# Altium project Controller.PrjPcb (part 4 of 5)

## Sheet MCU.SchDoc
size A4; SheetNumber: 3; SheetTotal: 9
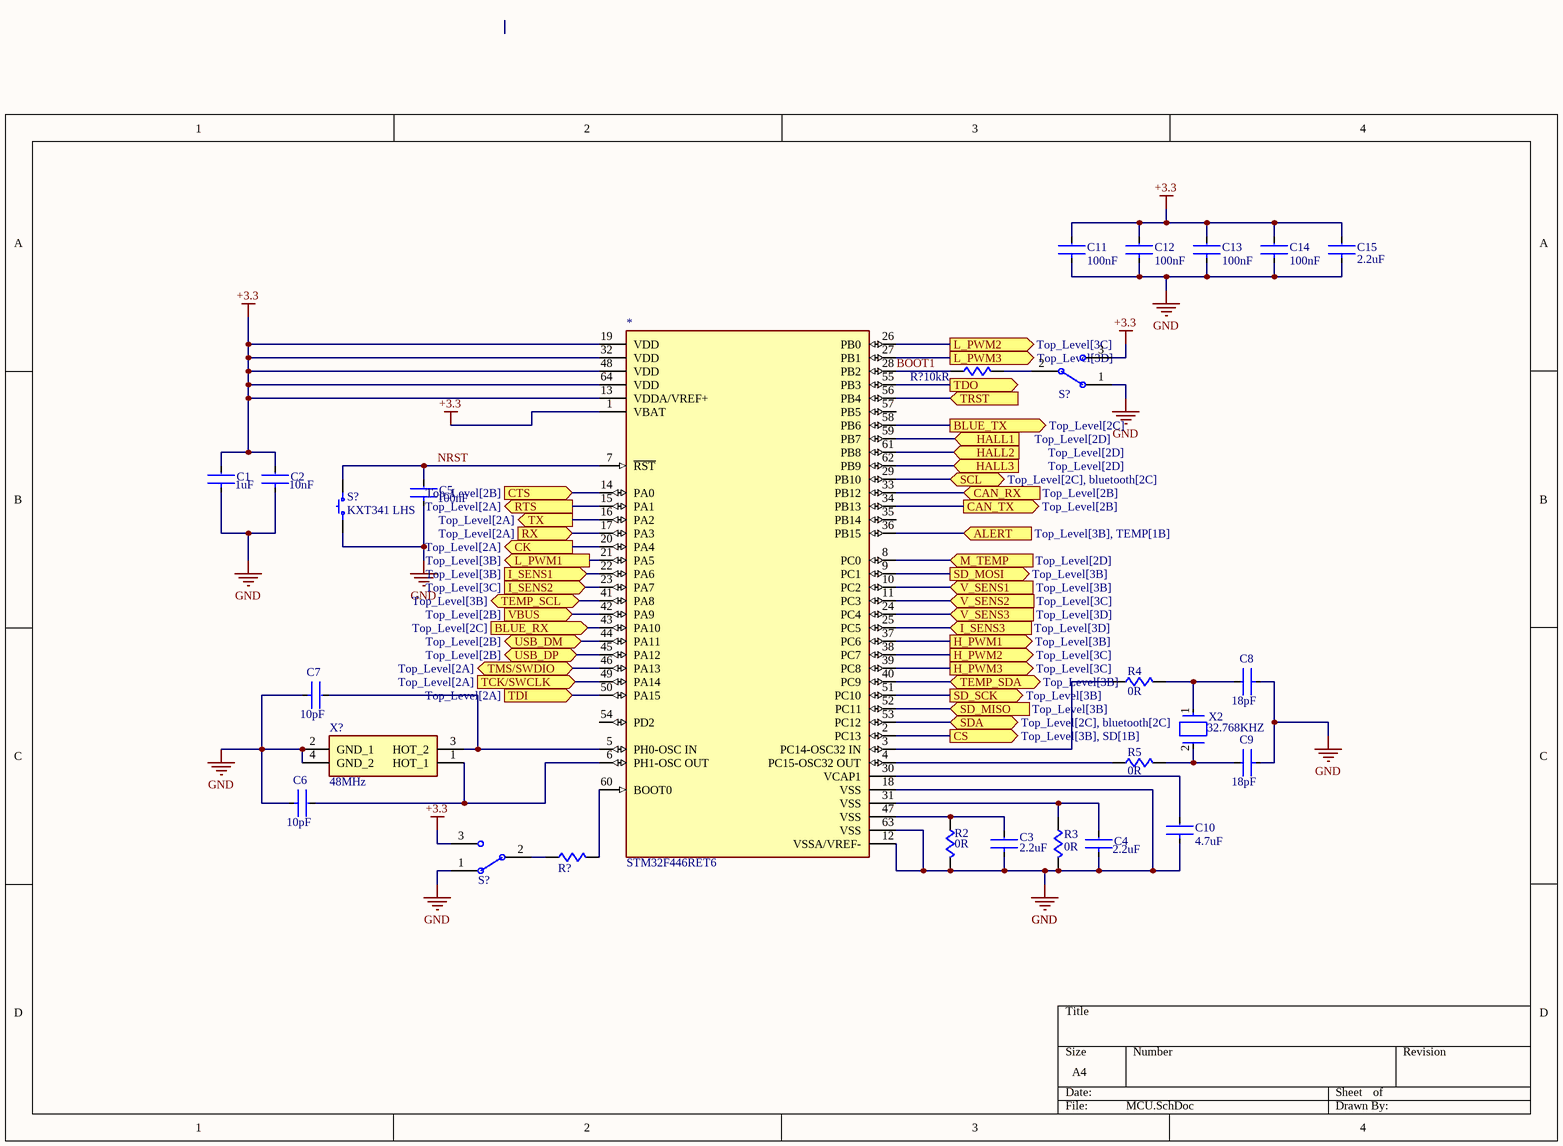
[diagram p3: MCU.SchDoc]

### Parts
(Parts that share a designator on the sheet are numbered #1, #2 ... from top to bottom, then left to right.)
*  STM32F446RET6  [FP-LQFP64-5W-IPC_B]
C1  value 1uF  [FP-CGA3E-0_3-0_1-IPC_C]  (hidden comment: CER 1UF 16V X7R 0603)
C2  value 10nF  [FP-CGA3E-0_3-0_1-IPC_C]  (hidden comment: CER 10000PF 100V X7R 0603)
C3  value 2.2uF  [FP-GRT188-0_2-IPC_A]  (hidden comment: CER 2.2UF 25V X6S 0603)
C4  value 2.2uF  [FP-GRT188-0_2-IPC_A]  (hidden comment: CER 2.2UF 25V X6S 0603)
C5  value 100nF  [FP-CGA3E-0_3-0_1-IPC_C]  (hidden comment: CER 0.1UF 50V X7R 0603)
C6  value 10pF  [FP-GCM188-0_1-IPC_C]  (hidden comment: CER 10PF 100V C0G/NP0 0603)
C7  value 10pF  [FP-GCM188-0_1-IPC_C]  (hidden comment: CER 10PF 100V C0G/NP0 0603)
C8  value 18pF  [FP-GCM188-0_1-IPC_C]  (hidden comment: CER 18PF 100V C0G/NP0 0603)
C9  value 18pF  [FP-GCM188-0_1-IPC_C]  (hidden comment: CER 18PF 100V C0G/NP0 0603)
C10  value 4.7uF  [FP-GCM31C-0_2-e0_3_0_8-IPC_C]  (hidden comment: CER 4.7UF 25V X7R 1206)
C11  value 100nF  [FP-CGA3E-0_3-0_1-IPC_C]  (hidden comment: CER 0.1UF 50V X7R 0603)
C12  value 100nF  [FP-CGA3E-0_3-0_1-IPC_C]  (hidden comment: CER 0.1UF 50V X7R 0603)
C13  value 100nF  [FP-CGA3E-0_3-0_1-IPC_C]  (hidden comment: CER 0.1UF 50V X7R 0603)
C14  value 100nF  [FP-CGA3E-0_3-0_1-IPC_C]  (hidden comment: CER 0.1UF 50V X7R 0603)
C15  value 2.2uF  [FP-GRT188-0_2-IPC_A]  (hidden comment: CER 2.2UF 25V X6S 0603)
R2  value 0R  [FP-RK73Z1J-IPC_C]  (hidden comment: RES 0 OHM JUMPER 0603)
R3  value 0R  [FP-RK73Z1J-IPC_C]  (hidden comment: RES 0 OHM JUMPER 0603)
R4  value 0R  [FP-RK73Z1J-IPC_C]  (hidden comment: RES 0 OHM JUMPER 0603)
R5  value 0R  [FP-RK73Z1J-IPC_C]  (hidden comment: RES 0 OHM JUMPER 0603)
R?#19  value 10kR  [FP-AC0402-IPC_B]  (hidden comment: RES SMD 10K OHM 1% 1/16W 0402)
R?#20  RES SMD 10K OHM 1% 1/16W 0402  [FP-AC0402-IPC_B]  (value not drawn)
S?#1  SLIDE SWITCH SPDT T/H ON-ON BBM  [OS102011MS2QN1C]  (value not drawn)
S?#2  KXT341 LHS  [C&K KXT3]
S?#3  SLIDE SWITCH SPDT T/H ON-ON BBM  [OS102011MS2QN1C]  (value not drawn)
X2  Operating Frequency-Nom: 32.768KHZ  [FP-NX3215SA-MFG]  (hidden comment: 32.7680KHZ 12.5PF SMD)
X?#1  value 48MHz  [CX3225SB48000D0FPJC1]  (hidden comment: CRYSTAL 48.0000MHZ 8PF SMD)

### Ports
ALERT (in, see Top_Level[3B], TEMP[1B]), BLUE_RX (in, see Top_Level[2C]), BLUE_TX (out, see Top_Level[2C]), CAN_RX (in, see Top_Level[2B]), CAN_TX (out, see Top_Level[2B]), CK (out, see Top_Level[2A]), CS (out, see Top_Level[3B], SD[1B]), CTS (in, see Top_Level[2B]), H_PWM1 (out, see Top_Level[3B]), H_PWM2 (out, see Top_Level[3C]), H_PWM3 (out, see Top_Level[3C]), HALL1 (in, see Top_Level[2D]), HALL2 (in, see Top_Level[2D]), HALL3 (in, see Top_Level[2D]), I_SENS1 (in, see Top_Level[3B]), I_SENS2 (in, see Top_Level[3C]), I_SENS3 (in, see Top_Level[3D]), L_PWM1 (out, see Top_Level[3B]), L_PWM2 (out, see Top_Level[3C]), L_PWM3 (out, see Top_Level[3D]), M_TEMP (in, see Top_Level[2D]), RTS (out, see Top_Level[2A]), RX (in, see Top_Level[2A]), SCL (bidir, see Top_Level[2C], bluetooth[2C]), SD_MISO (in, see Top_Level[3B]), SD_MOSI (out, see Top_Level[3B]), SD_SCK (out, see Top_Level[3B]), SDA (bidir, see Top_Level[2C], bluetooth[2C]), TCK/SWCLK (in, see Top_Level[2A]), TDI (in, see Top_Level[2A]), TDO (out, see Top_Level[2A]), TEMP_SCL (bidir, see Top_Level[3B]), TEMP_SDA (bidir, see Top_Level[3B]), TMS/SWDIO (bidir, see Top_Level[2A]), TRST (in, see Top_Level[2A]), TX (out, see Top_Level[2A]), USB_DM (bidir, see Top_Level[2B]), USB_DP (bidir, see Top_Level[2B]), V_SENS1 (in, see Top_Level[3B]), V_SENS2 (in, see Top_Level[3C]), V_SENS3 (in, see Top_Level[3D]), VBUS (in, see Top_Level[2B])

### Nets
+3.3: *.1(VBAT) *.13(VDDA/VREF+) *.19(VDD) *.32(VDD) *.48(VDD) *.64(VDD) C1.2 C2.2 C11.2 C12.2 C13.2 C14.2 C15.2 S?#1.3(NC) S?#3.3(NC)
GND: *.12(VSSA/VREF-) *.18(VSS) *.63(VSS) C1.1 C2.1 C3.1 C4.1 C5.1 C6.1 C7.1 C8.1 C9.1 C10.1 C11.1 C12.1 C13.1 C14.1 C15.1 R2.2 R3.2 S?#1.1(NO) S?#2.1 S?#3.1(NO) X?#1.2(GND_1) X?#1.4(GND_2)
BOOT1: *.28(PB2) R?#19.1
NRST: *.7(~{RST}) C5.2 S?#2.2
Net*_2: *.2(PC13) ; port CS
Net*_3: *.3(PC14-OSC32_IN) R4.1
Net*_4: *.4(PC15-OSC32_OUT) R5.1
Net*_5: *.5(PH0-OSC_IN) C7.2 X?#1.3(HOT_2)
Net*_6: *.6(PH1-OSC_OUT) C6.2 X?#1.1(HOT_1)
Net*_8: *.8(PC0) ; port M_TEMP
Net*_9: *.9(PC1) ; port SD_MOSI
Net*_10: *.10(PC2) ; port V_SENS1
Net*_11: *.11(PC3) ; port V_SENS2
Net*_14: *.14(PA0) ; port CTS
Net*_15: *.15(PA1) ; port RTS
Net*_16: *.16(PA2) ; port TX
Net*_17: *.17(PA3) ; port RX
Net*_20: *.20(PA4) ; port CK
Net*_21: *.21(PA5) ; port L_PWM1
Net*_22: *.22(PA6) ; port I_SENS1
Net*_23: *.23(PA7) ; port I_SENS2
Net*_24: *.24(PC4) ; port V_SENS3
Net*_25: *.25(PC5) ; port I_SENS3
Net*_26: *.26(PB0) ; port L_PWM2
Net*_27: *.27(PB1) ; port L_PWM3
Net*_29: *.29(PB10) ; port SCL
Net*_30: *.30(VCAP1) C10.2
Net*_31: *.31(VSS) C4.2 R3.1
Net*_33: *.33(PB12) ; port CAN_RX
Net*_34: *.34(PB13) ; port CAN_TX
Net*_36: *.36(PB15) ; port ALERT
Net*_37: *.37(PC6) ; port H_PWM1
Net*_38: *.38(PC7) ; port H_PWM2
Net*_39: *.39(PC8) ; port H_PWM3
Net*_40: *.40(PC9) ; port TEMP_SDA
Net*_41: *.41(PA8) ; port TEMP_SCL
Net*_42: *.42(PA9) ; port VBUS
Net*_43: *.43(PA10) ; port BLUE_RX
Net*_44: *.44(PA11) ; port USB_DM
Net*_45: *.45(PA12) ; port USB_DP
Net*_46: *.46(PA13) ; port TMS/SWDIO
Net*_47: *.47(VSS) C3.2 R2.1
Net*_49: *.49(PA14) ; port TCK/SWCLK
Net*_50: *.50(PA15) ; port TDI
Net*_51: *.51(PC10) ; port SD_SCK
Net*_52: *.52(PC11) ; port SD_MISO
Net*_53: *.53(PC12) ; port SDA
Net*_55: *.55(PB3) ; port TDO
Net*_56: *.56(PB4) ; port TRST
Net*_58: *.58(PB6) ; port BLUE_TX
Net*_59: *.59(PB7) ; port HALL1
Net*_60: *.60(BOOT0) R?#20.2
Net*_61: *.61(PB8) ; port HALL2
Net*_62: *.62(PB9) ; port HALL3
NetC8_2: C8.2 R4.2 X2.1
NetC9_2: C9.2 R5.2 X2.2
NetR?#19_2: R?#19.2 S?#1.2(COM)
NetR?#20_1: R?#20.1 S?#3.2(COM)

Not connected (* = marked no-connect by the designer): * 35(PB14) 54(PD2) 57(PB5)

### Notes on the sheet
- Labels drawn without touching a wire or pin: GND

### Library data of the parts
* = STM32F446RET6: RISC Microcontroller, 32-Bit, FLASH, CORTEX-M4F CPU, 180MHz, CMOS, PQFP64; Manufacturer: STMicroelectronics; Package Body Material: Plastic; Package Equivalence Code: QFP64,.47SQ,20; Power Supplies: 1.8/3.3V; Speed: 180RPM; Max Supply Current: 115mA; Qualification Status: Not Qualified; Supplier: Digi-Key; Supplier Part Number: 497-15376-ND; Manufacturer Part Number: STM32F446RET6; RoHS: Yes; Category: Microcontrollers; Stock: 18601; Pricing: 1=11.57, 10=10.456, 25=9.9696, 160=8.65644, 320=8.26741, 480=7.53794, 960=6.9474 (USD); Case/Package: QFP; Pins: 64; Package Shape: Square; Min Operating Temperature: -40°C; Max Operating Temperature: 85°C; JESD-30 Code: S-PQFP-G64; Package Style: FLATPACKMeter; Surface Mount: Yes; Technology: CMOS; Terminal Form: Gull Wing; Terminal Position: QUAD; Terminal Pitch: 0.5mm; Temperature Grade: INDUSTRIAL; Reach SVHC Compliant: Yes; RoHS Compliant: Yes; ComponentLink1URL: https://datasheet.ciiva.com:443/pdfs/VipMasterIC/IC/SGST/SGST-S-A0000954157/SGST-S-A0000954273-1.pdf?src-supplier=IHS+Markit; ComponentLink1Description: https://datasheet.ciiva.com:443/pdfs/VipMasterIC/IC/SGST/SGST-S-A0000954157/SGST-S-A0000954273-1.pdf?src-supplier=IHS+Markit; ComponentLink2URL: http://www.mouser.com/ds/2/389/stm32f446mc-956216.pdf?src-supplier=Mouser; ComponentLink2Description: http://www.mouser.com/ds/2/389/stm32f446mc-956216.pdf?src-supplier=Mouser; ComponentLink3URL: http://www.farnell.com/datasheets/2309063.pdf?src-supplier=Farnell; ComponentLink3Description: http://www.farnell.com/datasheets/2309063.pdf?src-supplier=Farnell; ComponentLink4URL: http://www.farnell.com/datasheets/2309063.pdf?src-supplier=Element14; ComponentLink4Description: http://www.farnell.com/datasheets/2309063.pdf?src-supplier=Element14; ComponentLink5URL: http://www.st.com/content/ccc/resource/technical/document/datasheet/65/cb/75/50/53/d6/48/24/DM00141306.pdf/files/DM00141306.pdf/jcr:content/translations/en.DM00141306.pdf?src-supplier=Digi-Key; ComponentLink5Description: http://www.st.com/content/ccc/resource/technical/document/datasheet/65/cb/75/50/53/d6/48/24/DM00141306.pdf/files/DM00141306.pdf/jcr:content/translations/en.DM00141306.pdf?src-supplier=Digi-Key; ComponentLink6URL: http://www.farnell.com/datasheets/2309063.pdf?src-supplier=Newark; ComponentLink6Description: http://www.farnell.com/datasheets/2309063.pdf?src-supplier=Newark
C1 = CGA3E1X7R1C105K080AC: Manufacturer: TDK; Dielectric Material: Ceramic; Multilayer: Yes; Tolerance  (fill in as +-): 10%; Reference Standard: AEC-Q200; Supplier: Digi-Key; Supplier Part Number: 445-12539-1-ND; Manufacturer Part Number: CGA3E1X7R1C105K080AC; RoHS: Yes; Category: Ceramic Capacitors; Stock: 2379528; Pricing: 1=0.12, 10=0.088, 50=0.0498, 100=0.0413, 500=0.02896, 1000=0.02397 (USD); Mounting Technology: Surface Mount; Pins: 2; Package Shape: Rectangular; Case/Package: 0603; Terminal Finish: Nickel; Min Operating Temperature: -55°C; Max Operating Temperature: 125°C; JESD-609 Code: e3; Capacitor Type: Ceramic; Package Style: SMTMeter; Packaging: Tape and Reel; Tolerance (fill in as +-): 10%; Rated DC Voltage (URdc): 16V; Temperature Characteristics Code: X7R; Termination: Wraparound; Length: 1.6mm; Width: 0.8mm; Height: 0.8mm; Reach SVHC Compliant: Yes; RoHS Compliant: Yes; ComponentLink1URL: https://datasheet.ciiva.com:443/pdfs/VipMasterIC/IC/TDKC/TDKC-S-A0008953915/TDKC-S-A0008953915-1.pdf?src-supplier=IHS+Markit; ComponentLink1Description: https://datasheet.ciiva.com:443/pdfs/VipMasterIC/IC/TDKC/TDKC-S-A0008953915/TDKC-S-A0008953915-1.pdf?src-supplier=IHS+Markit; ComponentLink2URL: http://www.farnell.com/datasheets/2292075.pdf?src-supplier=Farnell; ComponentLink2Description: http://www.farnell.com/datasheets/2292075.pdf?src-supplier=Farnell; ComponentLink3URL: https://product.tdk.com/info/en/documents/chara_sheet/CGA3E1X7R1C105K080AC.pdf?src-supplier=Digi-Key; ComponentLink3Description: https://product.tdk.com/info/en/documents/chara_sheet/CGA3E1X7R1C105K080AC.pdf?src-supplier=Digi-Key; ComponentLink4URL: https://product.tdk.com/info/en/catalog/datasheets/mlcc_automotive_general_en.pdf?src-supplier=Digi-Key; ComponentLink4Description: https://product.tdk.com/info/en/catalog/datasheets/mlcc_automotive_general_en.pdf?src-supplier=Digi-Key; ComponentLink5URL: http://product.tdk.com/capacitor/mlcc/en/documents/mlcc_automotive_general_en.pdf?src-supplier=Avnet; ComponentLink5Description: http://product.tdk.com/capacitor/mlcc/en/documents/mlcc_automotive_general_en.pdf?src-supplier=Avnet; ComponentLink6URL: http://www.farnell.com/datasheets/2292075.pdf?src-supplier=Element14; ComponentLink6Description: http://www.farnell.com/datasheets/2292075.pdf?src-supplier=Element14; ComponentLink7URL: http://www.farnell.com/datasheets/2292075.pdf?src-supplier=Newark; ComponentLink7Description: http://www.farnell.com/datasheets/2292075.pdf?src-supplier=Newark; ComponentLink8URL: http://product.tdk.com/capacitor/mlcc/detailed_information.php?lang=en&ref=jp&part_no=CGA3E1X7R1C105K080AC&src-supplier=Mouser; ComponentLink8Description: http://product.tdk.com/capacitor/mlcc/detailed_information.php?lang=en&ref=jp&part_no=CGA3E1X7R1C105K080AC&src-supplier=Mouser
C2 = GCM188R72A103KA37D: Manufacturer: Murata; Dielectric Material: Ceramic; Multilayer: Yes; Tolerance  (fill in as +-): 10%; Reference Standard: AEC-Q200; Supplier: Digi-Key; Supplier Part Number: 490-4781-1-ND; Manufacturer Part Number: GCM188R72A103KA37D; RoHS: Yes; Category: Ceramic Capacitors; Stock: 8991008; Pricing: 1=0.1, 10=0.057, 50=0.031, 100=0.0252, 500=0.01802, 1000=0.01417 (USD); Mounting Technology: Surface Mount; Pins: 2; Package Shape: Rectangular; Case/Package: 0603; Terminal Finish: Nickel; Min Operating Temperature: -55°C; Max Operating Temperature: 125°C; JESD-609 Code: e3; Capacitor Type: Ceramic; Package Style: SMTMeter; Packaging: Tape and Reel; Tolerance (fill in as +-): 10%; Rated DC Voltage (URdc): 100V; Temperature Characteristics Code: X7R; Termination: Wraparound; Length: 1.6mm; Width: 0.8mm; Height: 0.9mm; Reach SVHC Compliant: Yes; RoHS Compliant: Yes; ComponentLink1URL: https://psearch.en.murata.com:443/capacitor/product/GCM188R72A103KA37%23.pdf?src-supplier=IHS+Markit; ComponentLink1Description: https://psearch.en.murata.com:443/capacitor/product/GCM188R72A103KA37%23.pdf?src-supplier=IHS+Markit; ComponentLink2URL: https://datasheet.ciiva.com/132/product-132908.pdf?src-supplier=Digi-Key; ComponentLink2Description: https://datasheet.ciiva.com/132/product-132908.pdf?src-supplier=Digi-Key; ComponentLink3URL: https://datasheet.ciiva.com/132/product-132907.pdf?src-supplier=Digi-Key; ComponentLink3Description: https://datasheet.ciiva.com/132/product-132907.pdf?src-supplier=Digi-Key; ComponentLink4URL: https://datasheet.ciiva.com/132/product-132909.pdf?src-supplier=Digi-Key; ComponentLink4Description: https://datasheet.ciiva.com/132/product-132909.pdf?src-supplier=Digi-Key; ComponentLink5URL: https://datasheet.ciiva.com/16497/product-16497251.pdf?src-supplier=Future+Electronics; ComponentLink5Description: https://datasheet.ciiva.com/16497/product-16497251.pdf?src-supplier=Future+Electronics; ComponentLink6URL: https://datasheet.ciiva.com/18183/getdatasheetpartid-178890-18183651.pdf?src-supplier=Verical; ComponentLink6Description: https://datasheet.ciiva.com/18183/getdatasheetpartid-178890-18183651.pdf?src-supplier=Verical; ComponentLink7URL: https://datasheet.ciiva.com/11786/0900766b80ef92d0-11786108.pdf?src-supplier=Rs; ComponentLink7Description: https://datasheet.ciiva.com/11786/0900766b80ef92d0-11786108.pdf?src-supplier=Rs; ComponentLink8URL: https://datasheet.ciiva.com/11619/product-11619719.pdf?src-supplier=Avnet; ComponentLink8Description: https://datasheet.ciiva.com/11619/product-11619719.pdf?src-supplier=Avnet
C3 C4 C15 = GRT188C81E225KE13D: Manufacturer: Murata; Dielectric Material: Ceramic; Multilayer: Yes; Tolerance  (fill in as +-): 10%; Reference Standard: AEC-Q200; Supplier: Digi-Key; Supplier Part Number: 490-12293-1-ND; Manufacturer Part Number: GRT188C81E225KE13D; RoHS: Yes; Category: Ceramic Capacitors; Stock: 90858; Pricing: 1=0.28, 10=0.19, 50=0.1264, 100=0.1075, 500=0.07588, 1000=0.06639 (USD); Mounting Technology: Surface Mount; Pins: 2; Package Shape: Rectangular; Case/Package: 0603; Terminal Finish: Nickel; Min Operating Temperature: -55°C; Max Operating Temperature: 105°C; JESD-609 Code: e3; Capacitor Type: Ceramic; Packaging: Tape and Reel; Tolerance (fill in as +-): 10%; Rated DC Voltage (URdc): 25V; Temperature Characteristics Code: X6S; Termination: Wraparound; Reach SVHC Compliant: Yes; RoHS Compliant: Yes; ComponentLink1URL: https://datasheet.ciiva.com:443/pdfs/VipMasterIC/IC/MURE/MURE-S-A0004410517/MURE-S-A0004413790-1.pdf?src-supplier=IHS+Markit; ComponentLink1Description: https://datasheet.ciiva.com:443/pdfs/VipMasterIC/IC/MURE/MURE-S-A0004410517/MURE-S-A0004413790-1.pdf?src-supplier=IHS+Markit; ComponentLink2URL: http://www.farnell.com/datasheets/2165949.pdf?src-supplier=Farnell; ComponentLink2Description: http://www.farnell.com/datasheets/2165949.pdf?src-supplier=Farnell; ComponentLink3URL: http://search.murata.co.jp/Ceramy/image/img/A01X/G101/ENG/GRT188C81E225KE13-01.pdf?src-supplier=Digi-Key; ComponentLink3Description: http://search.murata.co.jp/Ceramy/image/img/A01X/G101/ENG/GRT188C81E225KE13-01.pdf?src-supplier=Digi-Key
C5 C11-C14 = CGA3E2X7R1H104K080AA: Manufacturer: TDK; Dielectric Material: Ceramic; Multilayer: Yes; Tolerance  (fill in as +-): 10%; Reference Standard: AEC-Q200; Supplier: Digi-Key; Supplier Part Number: 445-5666-1-ND; Manufacturer Part Number: CGA3E2X7R1H104K080AA; RoHS: Yes; Category: Ceramic Capacitors; Stock: 7530246; Pricing: 1=0.1, 10=0.067, 50=0.0364, 100=0.0297, 500=0.0212, 1000=0.01666 (USD); Mounting Technology: Surface Mount; Pins: 2; Package Shape: Rectangular; Case/Package: 0603; Terminal Finish: Nickel; Min Operating Temperature: -55°C; Max Operating Temperature: 125°C; Capacitor Type: Ceramic; JESD-609 Code: e3; Package Style: SMTMeter; Packaging: Tape and Reel; Tolerance (fill in as +-): 10%; Rated DC Voltage (URdc): 50V; Temperature Characteristics Code: X7R; Termination: Wraparound; Length: 1.6mm; Width: 0.8mm; Height: 0.8mm; Reach SVHC Compliant: Yes; RoHS Compliant: Yes; ComponentLink1URL: https://datasheet.ciiva.com:443/pdfs/VipMasterIC/IC/TDKC/TDKC-S-A0008953915/TDKC-S-A0008953915-1.pdf?src-supplier=IHS+Markit; ComponentLink1Description: https://datasheet.ciiva.com:443/pdfs/VipMasterIC/IC/TDKC/TDKC-S-A0008953915/TDKC-S-A0008953915-1.pdf?src-supplier=IHS+Markit; ComponentLink2URL: https://datasheet.ciiva.com/24216/cga3e2x7r1h104k080aa-266291-24216208.pdf?src-supplier=Mouser; ComponentLink2Description: https://datasheet.ciiva.com/24216/cga3e2x7r1h104k080aa-266291-24216208.pdf?src-supplier=Mouser; ComponentLink3URL: https://datasheet.ciiva.com/15192/getdatasheetpartid-715867-15192412.pdf?src-supplier=Verical; ComponentLink3Description: https://datasheet.ciiva.com/15192/getdatasheetpartid-715867-15192412.pdf?src-supplier=Verical; ComponentLink4URL: https://datasheet.ciiva.com/23803/1936565-23803084.pdf?src-supplier=Newark; ComponentLink4Description: https://datasheet.ciiva.com/23803/1936565-23803084.pdf?src-supplier=Newark; ComponentLink5URL: https://datasheet.ciiva.com/22725/1735392-22725642.pdf?src-supplier=Element14; ComponentLink5Description: https://datasheet.ciiva.com/22725/1735392-22725642.pdf?src-supplier=Element14; ComponentLink6URL: https://datasheet.ciiva.com/46385/1735392-46385708.pdf?src-supplier=Element14; ComponentLink6Description: https://datasheet.ciiva.com/46385/1735392-46385708.pdf?src-supplier=Element14; ComponentLink7URL: https://datasheet.ciiva.com/16500/mlccspec-automotive-general-midvoltage-en-16500693.pdf?src-supplier=Future+Electronics; ComponentLink7Description: https://datasheet.ciiva.com/16500/mlccspec-automotive-general-midvoltage-en-16500693.pdf?src-supplier=Future+Electronics
C6 C7 = GCM1885C2A100JA16D: Manufacturer: Murata; Dielectric Material: Ceramic; Multilayer: Yes; Tolerance  (fill in as +-): 5%; Temperature Characteristics Code: C0G; Reference Standard: AEC-Q200; Supplier: Digi-Key; Supplier Part Number: 490-4770-1-ND; Manufacturer Part Number: GCM1885C2A100JA16D; RoHS: Yes; Category: Ceramic Capacitors; Stock: 353737; Pricing: 1=0.11, 10=0.078, 50=0.0446, 100=0.0369, 500=0.02588, 1000=0.02142 (USD); Mounting Technology: Surface Mount; Pins: 2; Package Shape: Rectangular; Case/Package: 0603; Terminal Finish: Nickel; Min Operating Temperature: -55°C; Max Operating Temperature: 125°C; JESD-609 Code: e3; Capacitor Type: Ceramic; Package Style: SMTMeter; Packaging: Tape and Reel; Tolerance (fill in as +-): 5%; Rated DC Voltage (URdc): 100V; Termination: Wraparound; Length: 1.6mm; Width: 0.8mm; Height: 0.9mm; Reach SVHC Compliant: Yes; RoHS Compliant: Yes; ComponentLink1URL: https://datasheet.ciiva.com:443/pdfs/VipMasterIC/IC/MURE/MURE-S-A0004365318/MURE-S-A0004370306-1.pdf?src-supplier=IHS+Markit; ComponentLink1Description: https://datasheet.ciiva.com:443/pdfs/VipMasterIC/IC/MURE/MURE-S-A0004365318/MURE-S-A0004370306-1.pdf?src-supplier=IHS+Markit; ComponentLink2URL: https://datasheet.ciiva.com/133/product-133481.pdf?src-supplier=Digi-Key; ComponentLink2Description: https://datasheet.ciiva.com/133/product-133481.pdf?src-supplier=Digi-Key; ComponentLink3URL: https://datasheet.ciiva.com/133/product-133480.pdf?src-supplier=Digi-Key; ComponentLink3Description: https://datasheet.ciiva.com/133/product-133480.pdf?src-supplier=Digi-Key; ComponentLink4URL: https://datasheet.ciiva.com/133/product-133482.pdf?src-supplier=Digi-Key; ComponentLink4Description: https://datasheet.ciiva.com/133/product-133482.pdf?src-supplier=Digi-Key; ComponentLink5URL: https://datasheet.ciiva.com/18183/getdatasheetpartid-307287-18183583.pdf?src-supplier=Verical; ComponentLink5Description: https://datasheet.ciiva.com/18183/getdatasheetpartid-307287-18183583.pdf?src-supplier=Verical; ComponentLink6URL: https://datasheet.ciiva.com/11607/product-11607353.pdf?src-supplier=Avnet; ComponentLink6Description: https://datasheet.ciiva.com/11607/product-11607353.pdf?src-supplier=Avnet
C8 C9 = GCM1885C2A180JA16D: Manufacturer: Murata; Dielectric Material: Ceramic; Multilayer: Yes; Tolerance  (fill in as +-): 5%; Temperature Characteristics Code: C0G; Reference Standard: AEC-Q200; Supplier: Digi-Key; Supplier Part Number: 490-14762-1-ND; Manufacturer Part Number: GCM1885C2A180JA16D; RoHS: Yes; Category: Ceramic Capacitors; Stock: 156983; Pricing: 1=0.11, 10=0.075, 50=0.0424, 100=0.0351, 500=0.02464, 1000=0.0204 (USD); Mounting Technology: Surface Mount; Pins: 2; Package Shape: Rectangular; Case/Package: 0603; Terminal Finish: Nickel; Min Operating Temperature: -55°C; Max Operating Temperature: 125°C; JESD-609 Code: e3; Capacitor Type: Ceramic; Package Style: SMTMeter; Packaging: Tape and Reel; Tolerance (fill in as +-): 5%; Rated DC Voltage (URdc): 100V; Termination: Wraparound; Length: 1.6mm; Width: 0.8mm; Height: 0.9mm; Reach SVHC Compliant: Yes; RoHS Compliant: Yes; ComponentLink1URL: https://datasheet.ciiva.com:443/pdfs/VipMasterIC/IC/MURE/MURE-S-A0004365318/MURE-S-A0004370475-1.pdf?src-supplier=IHS+Markit; ComponentLink1Description: https://datasheet.ciiva.com:443/pdfs/VipMasterIC/IC/MURE/MURE-S-A0004365318/MURE-S-A0004370475-1.pdf?src-supplier=IHS+Markit; ComponentLink2URL: https://datasheet.ciiva.com/11607/product-11607829.pdf?src-supplier=Avnet; ComponentLink2Description: https://datasheet.ciiva.com/11607/product-11607829.pdf?src-supplier=Avnet; ComponentLink3URL: https://datasheet.ciiva.com/165/s0717e-165190.pdf?src-supplier=Digi-Key; ComponentLink3Description: https://datasheet.ciiva.com/165/s0717e-165190.pdf?src-supplier=Digi-Key
C10 = GCM31CR71E475KA55L: Manufacturer: Murata; Dielectric Material: Ceramic; Multilayer: Yes; Tolerance  (fill in as +-): 10%; Reference Standard: AEC-Q200; Supplier: Digi-Key; Supplier Part Number: 490-4794-1-ND; Manufacturer Part Number: GCM31CR71E475KA55L; RoHS: Yes; Category: Ceramic Capacitors; Stock: 351129; Pricing: 1=0.33, 10=0.226, 50=0.1584, 100=0.1357, 500=0.1018, 1000=0.08597 (USD); Mounting Technology: Surface Mount; Pins: 2; Package Shape: Rectangular; Case/Package: 1206; Terminal Finish: Nickel; Min Operating Temperature: -55°C; Max Operating Temperature: 125°C; JESD-609 Code: e3; Capacitor Type: Ceramic; Package Style: SMTMeter; Packaging: Tape and Reel; Tolerance (fill in as +-): 10%; Rated DC Voltage (URdc): 25V; Temperature Characteristics Code: X7R; Termination: Wraparound; Length: 3.2mm; Width: 1.6mm; Height: 1.8mm; Reach SVHC Compliant: Yes; RoHS Compliant: Yes; ComponentLink1URL: https://datasheet.ciiva.com:443/pdfs/VipMasterIC/IC/MURE/MURE-S-A0004442191/MURE-S-A0004445513-1.pdf?src-supplier=IHS+Markit; ComponentLink1Description: https://datasheet.ciiva.com:443/pdfs/VipMasterIC/IC/MURE/MURE-S-A0004442191/MURE-S-A0004445513-1.pdf?src-supplier=IHS+Markit; ComponentLink2URL: https://datasheet.ciiva.com/140/product-140163.pdf?src-supplier=Digi-Key; ComponentLink2Description: https://datasheet.ciiva.com/140/product-140163.pdf?src-supplier=Digi-Key; ComponentLink3URL: https://datasheet.ciiva.com/18183/getdatasheetpartid-255795-18183748.pdf?src-supplier=Verical; ComponentLink3Description: https://datasheet.ciiva.com/18183/getdatasheetpartid-255795-18183748.pdf?src-supplier=Verical; ComponentLink4URL: https://datasheet.ciiva.com/11787/0900766b80ef92d0-11787096.pdf?src-supplier=Rs; ComponentLink4Description: https://datasheet.ciiva.com/11787/0900766b80ef92d0-11787096.pdf?src-supplier=Rs; ComponentLink5URL: https://datasheet.ciiva.com/140/product-140162.pdf?src-supplier=Digi-Key; ComponentLink5Description: https://datasheet.ciiva.com/140/product-140162.pdf?src-supplier=Digi-Key; ComponentLink6URL: https://datasheet.ciiva.com/140/product-140164.pdf?src-supplier=Digi-Key; ComponentLink6Description: https://datasheet.ciiva.com/140/product-140164.pdf?src-supplier=Digi-Key; ComponentLink7URL: https://datasheet.ciiva.com/11613/product-11613353.pdf?src-supplier=Avnet; ComponentLink7Description: https://datasheet.ciiva.com/11613/product-11613353.pdf?src-supplier=Avnet; ComponentLink8URL: https://datasheet.ciiva.com:443/pdfs/VipMasterIC/IC/TDKC/TDKC-S-A0008953915/TDKC-S-A0008953915-1.pdf?src-supplier=IHS+Markit; ComponentLink8Description: https://datasheet.ciiva.com:443/pdfs/VipMasterIC/IC/TDKC/TDKC-S-A0008953915/TDKC-S-A0008953915-1.pdf?src-supplier=IHS+Markit; ComponentLink9URL: https://product.tdk.com/info/en/catalog/datasheets/mlcc_automotive_general_en.pdf?src-supplier=Digi-Key; ComponentLink9Description: https://product.tdk.com/info/en/catalog/datasheets/mlcc_automotive_general_en.pdf?src-supplier=Digi-Key
R2-R5 = RK73Z1JTTD: Manufacturer: KOA Speer; Rated Temperature: 70°C; Package Height: 0.45mm; Package Length: 1.6mm; Package Width: 0.8mm; Reference Standard: AEC-Q200; Supplier: Digi-Key; Supplier Part Number: 2019-RK73Z1JTTDCT-ND; Manufacturer Part Number: RK73Z1JTTD; RoHS: Yes; Category: Chip SMD Resistors; Stock: 8562065; Pricing: 1=0.1, 10=0.016, 50=0.0088, 100=0.0065, 500=0.00396, 1000=0.00292 (USD); Mounting Technology: Surface Mount; Pins: 2; Case/Package: 0603; Terminal Finish: Nickel; Min Operating Temperature: -55°C; Max Operating Temperature: 155°C; JESD-609 Code: e3; Resistor Type: FIXED RESISTOR; Construction: Rectangular; Package Style: SMTMeter; Packaging: Tape and Reel; Termination: Wraparound; Reach SVHC Compliant: Yes; RoHS Compliant: Yes; ComponentLink1URL: https://datasheet.ciiva.com:443/pdfs/VipMasterIC/IC/KOAS/KOAS-S-A0009586251/KOAS-S-A0009586308-1.pdf?src-supplier=IHS+Markit; ComponentLink1Description: https://datasheet.ciiva.com:443/pdfs/VipMasterIC/IC/KOAS/KOAS-S-A0009586251/KOAS-S-A0009586308-1.pdf?src-supplier=IHS+Markit; ComponentLink2URL: https://datasheet.ciiva.com/7816/549012-7816884.pdf?src-supplier=Element14; ComponentLink2Description: https://datasheet.ciiva.com/7816/549012-7816884.pdf?src-supplier=Element14; ComponentLink3URL: https://datasheet.ciiva.com/26914/getdatasheetpartid-123499-26914653.pdf?src-supplier=Verical; ComponentLink3Description: https://datasheet.ciiva.com/26914/getdatasheetpartid-123499-26914653.pdf?src-supplier=Verical
R?#19 = AC0402FR-0710KL: Manufacturer: Yageo; Additional Feature: LASER TRIMMABLE; Power: 62.5mW; Rated Temperature: 70°C; Temperature Coefficient: 100ppm/°C; Working Voltage: 50V; Package Height: 0.32mm; Package Length: 1mm; Package Width: 0.5mm; Reference Standard: AEC-Q200; Supplier: Future Electronics; Supplier Part Number: 2025338; Manufacturer Part Number: AC0402FR-0710KL; RoHS: Yes; Category: Chip SMD Resistors; Stock: 15780000; Pricing: 10000=0.0014, 50000=0.0013, 250000=0.0012, 750000=0.0012, 2000000=0.0011 (USD); Mounting Technology: Surface Mount; Pins: 2; Package Shape: Rectangular; Case/Package: 0402; Terminal Finish: Nickel; Min Operating Temperature: -55°C; Max Operating Temperature: 155°C; Tolerance: 1%; JESD-609 Code: e3; Resistor Type: FIXED RESISTOR; Construction: Chip; Package Style: SMTMeter; Packaging: Tape and Reel; Technology: METAL GLAZE/THICK FILM; Termination: Wraparound; Reach SVHC Compliant: Yes; RoHS Compliant: Yes; ComponentLink1URL: https://datasheet.ciiva.com:443/pdfs/VipMasterIC/IC/YAGO/YAGO-S-A0003597364/YAGO-S-A0003597364-1.pdf?src-supplier=IHS+Markit; ComponentLink1Description: https://datasheet.ciiva.com:443/pdfs/VipMasterIC/IC/YAGO/YAGO-S-A0003597364/YAGO-S-A0003597364-1.pdf?src-supplier=IHS+Markit; ComponentLink2URL: https://datasheet.ciiva.com/12656/pyu-ac-51-rohs-l-2-12656634.pdf?src-supplier=Mouser; ComponentLink2Description: https://datasheet.ciiva.com/12656/pyu-ac-51-rohs-l-2-12656634.pdf?src-supplier=Mouser
R?#20 = AC0402FR-0710KL: Manufacturer: Yageo; Additional Feature: LASER TRIMMABLE; Power: 62.5mW; Rated Temperature: 70°C; Value: 10kR; Temperature Coefficient: 100ppm/°C; Working Voltage: 50V; Package Height: 0.32mm; Package Length: 1mm; Package Width: 0.5mm; Reference Standard: AEC-Q200; Supplier: Future Electronics; Supplier Part Number: 2025338; Manufacturer Part Number: AC0402FR-0710KL; RoHS: Yes; Category: Chip SMD Resistors; Stock: 15780000; Pricing: 10000=0.0014, 50000=0.0013, 250000=0.0012, 750000=0.0012, 2000000=0.0011 (USD); Mounting Technology: Surface Mount; Pins: 2; Package Shape: Rectangular; Case/Package: 0402; Terminal Finish: Nickel; Min Operating Temperature: -55°C; Max Operating Temperature: 155°C; Tolerance: 1%; JESD-609 Code: e3; Resistor Type: FIXED RESISTOR; Construction: Chip; Package Style: SMTMeter; Packaging: Tape and Reel; Technology: METAL GLAZE/THICK FILM; Termination: Wraparound; Reach SVHC Compliant: Yes; RoHS Compliant: Yes; ComponentLink1URL: https://datasheet.ciiva.com:443/pdfs/VipMasterIC/IC/YAGO/YAGO-S-A0003597364/YAGO-S-A0003597364-1.pdf?src-supplier=IHS+Markit; ComponentLink1Description: https://datasheet.ciiva.com:443/pdfs/VipMasterIC/IC/YAGO/YAGO-S-A0003597364/YAGO-S-A0003597364-1.pdf?src-supplier=IHS+Markit; ComponentLink2URL: https://datasheet.ciiva.com/12656/pyu-ac-51-rohs-l-2-12656634.pdf?src-supplier=Mouser; ComponentLink2Description: https://datasheet.ciiva.com/12656/pyu-ac-51-rohs-l-2-12656634.pdf?src-supplier=Mouser
S?#1 S?#3 = OS102011MS2QN1C: Manufacturer: ITT C&K; Actuator Material: Polyoxymethylene; Actuator Color: Black; Center Contact Plating: Silver; End Contact Material: Copper Alloy; Contact Current(DC)-Max: 100mA; Contact DC Max Rating R Load: .1A@12VDC; Contact Resistance: 0.02mR; Contact Voltage(DC)-Max: 12V; Dielectric Withstand Volts: 500VACV; Electrical Life: 10000Cycles; Insulation Resistance: 100MR; Number of Positions: 2; PCB Hole Count: 5; Switch Action: LATCHED; Actuator Length: 0.157inch; Body Breadth: 4.3inch; Body Height: 4.7mm; Body Length or Diameter: 8.6mm; Supplier: Digi-Key; Supplier Part Number: CKN12284-ND; Manufacturer Part Number: OS102011MS2QN1C; RoHS: Yes; Category: Slide Switches; Stock: 76323; Pricing: 1=0.61, 10=0.586, 25=0.5644, 100=0.4886, 250=0.44516, 500=0.41258, 1000=0.36916, 2500=0.34961, 5000=0.32355 (USD); Mounting Technology: Through Hole; Contact Material: Brass; Insulation Material: Phenolic; Terminal Finish: Gold; Terminal Material: Brass; Min Operating Temperature: -10°C; Max Operating Temperature: 70°C; JESD-609 Code: e4; Actuator Type: SLIDE; Contact Function: On-On; Packaging: Bulk; Switch Function: SPDT; Switch Type: Slide Switch; Termination: Solder; Reach SVHC Compliant: Yes; RoHS Compliant: Yes; ComponentLink1URL: https://datasheet.ciiva.com:443/pdfs/VipMasterIC/IC/CKCI/CKCI-S-A0002822563/CKCI-S-A0002822563-1.pdf?src-supplier=IHS+Markit; ComponentLink1Description: https://datasheet.ciiva.com:443/pdfs/VipMasterIC/IC/CKCI/CKCI-S-A0002822563/CKCI-S-A0002822563-1.pdf?src-supplier=IHS+Markit; ComponentLink2URL: https://datasheet.ciiva.com/46420/1839844-46420506.pdf?src-supplier=Element14; ComponentLink2Description: https://datasheet.ciiva.com/46420/1839844-46420506.pdf?src-supplier=Element14; ComponentLink3URL: https://datasheet.ciiva.com/18207/getdatasheetpartid-332577-18207383.pdf?src-supplier=Verical; ComponentLink3Description: https://datasheet.ciiva.com/18207/getdatasheetpartid-332577-18207383.pdf?src-supplier=Verical; ComponentLink4URL: https://datasheet.ciiva.com/8626/os-19jan15-8626502.pdf?src-supplier=Avnet; ComponentLink4Description: https://datasheet.ciiva.com/8626/os-19jan15-8626502.pdf?src-supplier=Avnet
S?#2 = KXT341 LHS: SWITCH TACTILE SPST-NO 0.02A 15V; Manufacturer: C&K; Actuator Height off PCB, Vertical: 0.60mm; Actuator Orientation: Top Actuated; Actuator Type: Standard; Contact Rating @ Voltage: 0.02A @ 15VDC; Illumination: Non-Illuminated; Operating Force: 330gf; Outline: 3.00mm x 2.00mm; Switch Function: Off-Mom; Part Number: KXT341 LHS; Circuit: SPST-NO; ComponentLink1Description: Datasheet; ComponentLink1URL: https://dznh3ojzb2azq.cloudfront.net/products/Tactile/KXT3/documents/datasheet.pdf; ComponentLink2Description: DigiKey Link; ComponentLink2URL: https://www.digikey.com/en/products/detail/c-k/KXT341-LHS/6607322; LastUpdated: 2023-06-04 8:46:36 PM; Lifecycle Status: Active; Minimum Order: 1; Mounting Type: Surface Mount; Operating Temperature: -40°C ~ 85°C; Packaging: TapeAndReel; Part Status: Active; Price: 0.13; Series: KXT3; Supplier 1: DigiKey; Supplier Part Number 1: CKN10781CT-ND; Termination Style: SMD (SMT) Tab
X2 = NX3215SA-32.768K-STD-MUS-2: Manufacturer: NDK; Crystal/Resonator Type: PARALLEL - FUNDAMENTAL; Drive Level: 0.1uW; Frequency Stability: 0.04%; Frequency Tolerance: 20ppm; ESR: 80kR; Supplier: Digi-Key; Supplier Part Number: 644-1159-1-ND; Manufacturer Part Number: NX3215SA-32.768K-STD-MUS-2; RoHS: Yes; Category: Crystals; Stock: 215942; Pricing: 1=0.72, 10=0.601, 50=0.5408, 100=0.4808, 500=0.45672, 1000=0.38461 (USD); Mounting Technology: Surface Mount; Min Operating Temperature: -40°C; Max Operating Temperature: 125°C; Load Capacitance: 12.5pF; Reach SVHC Compliant: Yes; RoHS Compliant: Yes; ComponentLink1URL: https://datasheet.ciiva.com:443/pdfs/VipMasterIC/IC/NDKC/NDKC-S-A0010064642/NDKC-S-A0010064682-1.pdf?src-supplier=IHS+Markit; ComponentLink1Description: https://datasheet.ciiva.com:443/pdfs/VipMasterIC/IC/NDKC/NDKC-S-A0010064642/NDKC-S-A0010064682-1.pdf?src-supplier=IHS+Markit; ComponentLink2URL: https://datasheet.ciiva.com/858/c-nx3215sa-std-mus-2-e-858632.pdf?src-supplier=Digi-Key; ComponentLink2Description: https://datasheet.ciiva.com/858/c-nx3215sa-std-mus-2-e-858632.pdf?src-supplier=Digi-Key
X?#1 = CX3225SB48000D0FPJC1

## Sheet CAN.SchDoc
size A4; SheetNumber: 7; SheetTotal: 9
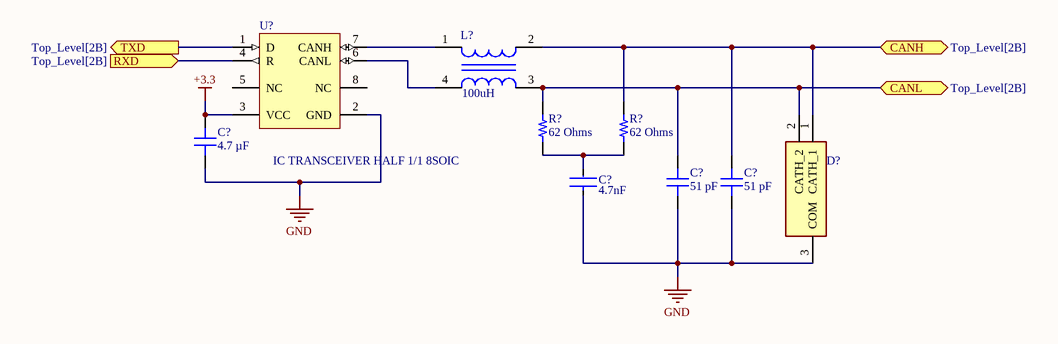
[diagram p4: CAN.SchDoc]

### Parts
(Parts that share a designator on the sheet are numbered #1, #2 ... from top to bottom, then left to right.)
C?#22  4.7 µF  [CAP 0603_1608]
C?#23  value 4.7nF  [FP-CGA3E-0_3-0_1-IPC_C]  (hidden comment: CER 4700PF 50V C0G 0603)
C?#24  51 pF  [CAP 0603_1608]
C?#25  51 pF  [CAP 0603_1608]
D?#4  TVS DIODE 24VWM 70VC TO236AB  [SOT95P230X110-3N]  (value not drawn)
L?#1  value 100uH  [FP-B82789C0-MFG]  (hidden comment: CMC 100UH 150MA 2LN SMD AEC-Q200)
R?#21  62 Ohms  [RES 1206_3216]
R?#22  62 Ohms  [RES 1206_3216]
U?#2  IC TRANSCEIVER HALF 1/1 8SOIC  [D0008A_M]

### Ports
CANH (bidir, see Top_Level[2B]), CANL (bidir, see Top_Level[2B]), RXD (in, see Top_Level[2B]), TXD (out, see Top_Level[2B])

### Nets
+3.3: C?#22.2 U?#2.3(VCC)
GND: C?#22.1 C?#23.1 C?#24.1 C?#25.1 D?#4.3(COM) U?#2.2(GND)
Net*_33: U?#2.1(D) ; port TXD
Net*_34: U?#2.4(R) ; port RXD
NetC?#23_2: C?#23.2 R?#21.1 R?#22.1
NetC?#24_2: C?#24.2 D?#4.2(CATH_2) L?#1.3 R?#21.2 ; port CANL
NetC?#25_2: C?#25.2 D?#4.1(CATH_1) L?#1.2 R?#22.2 ; port CANH
NetL?#1_1: L?#1.1 U?#2.7(CANH)
NetL?#1_4: L?#1.4 U?#2.6(CANL)

Not connected (* = marked no-connect by the designer): U?#2 5(NC) 8(NC)

### Library data of the parts
C?#22 = CGA3E1X5R0J475K080AC: CAP CER 4.7UF 6.3V X5R 0603; manufacturer: TDK Corporation; Tolerance: ±10%; Part Number: CGA3E1X5R0J475K080AC; Value: 4.7 µF; Applications: Automotive; Capacitance: 4.7 µF; componentlink1description: Datasheet; componentlink1url: https://product.tdk.com/info/en/catalog/datasheets/mlcc_automotive_general_en.pdf?ref_disty=digikey; componentlink2description: DigiKey Link; componentlink2url: https://www.digikey.com/en/products/detail/tdk-corporation/CGA3E1X5R0J475K080AC/2672827; Device Package: 0603 (1608 Metric); lastupdated: 2023-06-04 7:11:06 PM; Lifecycle Status: Active; Minimum Order: 1; Mounting Type: Surface Mount, MLCC; Operating Temperature: -55°C ~ 85°C; Package / Case: 0603 (1608 Metric); packaging: TapeAndReel; partid: 12825; Part Status: Active; price: 0.05; Ratings: AEC-Q200; series: CGA; Size / Dimension: 0.063" L x 0.031" W (1.60mm x 0.80mm); Supplier 1: DigiKey; Supplier Part Number 1: 445-6934-1-ND; Temperature Coefficient: X5R; Thickness (Max): 0.035" (0.90mm); Voltage - Rated: 6.3V
C?#23 = CGA3E2C0G1H472J080AA: CAP CER 4700PF 50V C0G 0603; Manufacturer: TDK; Dielectric Material: Ceramic; Multilayer: Yes; Tolerance  (fill in as +-): 5%; Reference Standard: AEC-Q200; Supplier: Digi-Key; Supplier Part Number: 445-6912-1-ND; Manufacturer Part Number: CGA3E2C0G1H472J080AA; RoHS: Yes; Category: Ceramic Capacitors; Stock: 784111; Pricing: 1=0.22, 10=0.152, 50=0.101, 100=0.0858, 500=0.0606, 1000=0.05302 (USD); Mounting Technology: Surface Mount; Pins: 2; Package Shape: Rectangular; Case/Package: 0603; Terminal Finish: Nickel; Min Operating Temperature: -55°C; Max Operating Temperature: 125°C; JESD-609 Code: e3; Capacitor Type: Ceramic; Package Style: SMTMeter; Packaging: Tape and Reel; Tolerance (fill in as +-): 5%; Rated DC Voltage (URdc): 50V; Temperature Characteristics Code: C0G; Termination: Wraparound; Length: 1.6mm; Width: 0.8mm; Height: 0.8mm; Reach SVHC Compliant: Yes; RoHS Compliant: Yes; ComponentLink1URL: https://datasheet.ciiva.com:443/pdfs/VipMasterIC/IC/TDKC/TDKC-S-A0008953915/TDKC-S-A0008953915-1.pdf?src-supplier=IHS+Markit; ComponentLink1Description: https://datasheet.ciiva.com:443/pdfs/VipMasterIC/IC/TDKC/TDKC-S-A0008953915/TDKC-S-A0008953915-1.pdf?src-supplier=IHS+Markit; ComponentLink2URL: https://datasheet.ciiva.com/24217/mlcc-automotive-general-en-24217054.pdf?src-supplier=Mouser; ComponentLink2Description: https://datasheet.ciiva.com/24217/mlcc-automotive-general-en-24217054.pdf?src-supplier=Mouser; ComponentLink3URL: https://datasheet.ciiva.com/6149/1807242-6149350.pdf?src-supplier=Farnell; ComponentLink3Description: https://datasheet.ciiva.com/6149/1807242-6149350.pdf?src-supplier=Farnell; ComponentLink4URL: https://datasheet.ciiva.com/7975/1807242-7975303.pdf?src-supplier=Element14; ComponentLink4Description: https://datasheet.ciiva.com/7975/1807242-7975303.pdf?src-supplier=Element14
C?#24 C?#25 = CC0603JRNPO9BN510: CAP CER 51PF 50V C0G/NPO 0603; manufacturer: Yageo; Temperature Coefficient: C0G, NP0; Tolerance: ±5%; Part Number: CC0603JRNPO9BN510; Value: 51 pF; Applications: General Purpose; Capacitance: 51 pF; componentlink1description: Datasheet; componentlink1url: https://www.yageo.com/upload/media/product/productsearch/datasheet/mlcc/UPY-GP_NP0_16V-to-50V_17.pdf; componentlink2description: DigiKey Link; componentlink2url: https://www.digikey.com/en/products/detail/yageo/CC0603JRNPO9BN510/5883618; Device Package: 0603 (1608 Metric); lastupdated: 2023-06-04 7:11:29 PM; Lifecycle Status: Active; Minimum Order: 1; Mounting Type: Surface Mount, MLCC; Operating Temperature: -55°C ~ 125°C; Package / Case: 0603 (1608 Metric); packaging: TapeAndReel; partid: 3610; Part Status: Active; price: 0.01; series: CC; Size / Dimension: 0.063" L x 0.031" W (1.60mm x 0.80mm); Supplier 1: DigiKey; Supplier Part Number 1: 311-3358-1-ND; Thickness (Max): 0.035" (0.90mm); Voltage - Rated: 50V
D?#4 = PESD1CAN,215: Trans Voltage Suppressor Diode, 200W, 24V V(RWM), Bidirectional, 2 Element, Silicon, TO-236AB; Manufacturer: Nexperia; Package Body Material: Plastic; Max Breakdown Voltage: 30.3V; Min Breakdown Voltage: 25.4V; Number of Elements: 2; Time @ Peak Reflow Temperature-Max (s): 40s; Reference Standard: IEC-60134; Qualification Status: Not Qualified; Supplier: Digi-Key; Supplier Part Number: 1727-3817-1-ND; Manufacturer Part Number: PESD1CAN,215; RoHS: Yes; Category: ESD and Circuit Protection ICs; Stock: 102526; Pricing: 1=0.45, 10=0.366, 100=0.2492, 500=0.18688, 1000=0.14016 (USD); Pins: 3; Diode Element Material: SILICON; Package Shape: Rectangular; Terminal Finish: Tin; Max Operating Temperature: 150°C; Polarity: Bidirectional; Diode Type: TRANS VOLTAGE SUPPRESSOR; JESD-30 Code: R-PDSO-G3; Non-rep Peak Rev Power Dis-Max: 200W; Package Style: SMALL OUTLINEMeter; Rep Pk Reverse Voltage-Max: 24V; Surface Mount: Yes; Technology: AVALANCHE; Terminal Form: Gull Wing; Terminal Position: DUAL; JESD-609 Code: e3; Moisture Sensitivity Level: 1; Peak Reflow Temperature (Cel): 260°C; Reach SVHC Compliant: Yes; RoHS Compliant: Yes; JEDEC-95 Code: TO-236AB; ComponentLink1URL: https://datasheet.ciiva.com:443/pdfs/VipMasterIC/IC/NEXP/NEXP-S-A0005722386/NEXP-S-A0005722386-1.pdf?src-supplier=IHS+Markit; ComponentLink1Description: https://datasheet.ciiva.com:443/pdfs/VipMasterIC/IC/NEXP/NEXP-S-A0005722386/NEXP-S-A0005722386-1.pdf?src-supplier=IHS+Markit; ComponentLink2URL: http://www.farnell.com/datasheets/109497.pdf?src-supplier=Farnell; ComponentLink2Description: http://www.farnell.com/datasheets/109497.pdf?src-supplier=Farnell; ComponentLink3URL: https://assets.nexperia.com/documents/data-sheet/PESD1CAN.pdf?src-supplier=Digi-Key; ComponentLink3Description: https://assets.nexperia.com/documents/data-sheet/PESD1CAN.pdf?src-supplier=Digi-Key; ComponentLink4URL: http://www.farnell.com/datasheets/109497.pdf?src-supplier=Newark; ComponentLink4Description: http://www.farnell.com/datasheets/109497.pdf?src-supplier=Newark
L?#1 = B82789C0104N002: Manufacturer: TDK EPCOS; DC Resistance-Max: 1.5R; Filter Type: DATA LINE FILTER; Channels: 2; Output Impedance: 50R; Voltage Rating: 80V; Supplier: Digi-Key; Supplier Part Number: 495-5751-1-ND; Manufacturer Part Number: B82789C0104N002; RoHS: Yes; Category: Fixed Inductors; Stock: 40158; Pricing: 1=1.7, 10=1.571, 25=1.44, 50=1.2304, 100=1.0995, 250=0.94244, 500=0.8901, 1000=0.81156 (USD); Mounting Technology: Surface Mount; Terminal Finish: Tin; Min Operating Temperature: -55°C; Max Operating Temperature: 125°C; JESD-609 Code: e3; Manufacturer Series: B82789C0; Packaging: Tape and Reel; Current Rating: 150mA; Length: 4.5mm; Height: 3mm; Reach SVHC Compliant: Yes; RoHS Compliant: Yes; ComponentLink1URL: https://datasheet.ciiva.com:443/pdfs/VipMasterIC/IC/TDKC/TDKC-S-A0008970033/TDKC-S-A0008970033-1.pdf?src-supplier=IHS+Markit; ComponentLink1Description: https://datasheet.ciiva.com:443/pdfs/VipMasterIC/IC/TDKC/TDKC-S-A0008970033/TDKC-S-A0008970033-1.pdf?src-supplier=IHS+Markit; ComponentLink2URL: https://datasheet.ciiva.com/22684/1899203-22684429.pdf?src-supplier=Element14; ComponentLink2Description: https://datasheet.ciiva.com/22684/1899203-22684429.pdf?src-supplier=Element14
R?#21 R?#22 = ERJ-P08J620V: RES SMD 62 OHM 5% 2/3W 1206; Manufacturer: Panasonic Electronic Components; Power (Watts): 0.667W, 2/3W; Temperature Coefficient: ±200ppm/°C; Part Number: ERJ-P08J620V; ComponentLink1Description: Datasheet; ComponentLink1URL: https://industrial.panasonic.com/cdbs/www-data/pdf/RDO0000/AOA0000C331.pdf; ComponentLink2Description: DigiKey Link; ComponentLink2URL: https://www.digikey.com/en/products/detail/panasonic-electronic-components/ERJ-P08J620V/525410; Composition: Thick Film; Device Package: 1206 (3216 Metric); Features: Automotive AEC-Q200, Pulse Withstanding; Height - Seated (Max): 0.028" (0.70mm); LastUpdated: 2023-06-03 7:49:04 PM; Lifecycle Status: Active; Minimum Order: 1; Number of Terminations: 2; Operating Temperature: -55°C ~ 155°C; Package / Case: 1206 (3216 Metric); Packaging: TapeAndReel; PartId: 32942; Part Status: Active; Price: 0.02; Ratings: AEC-Q200; Resistance: 62 Ohms; Series: ERJ-P08; Size / Dimension: 0.126" L x 0.063" W (3.20mm x 1.60mm); Supplier 1: DigiKey; Supplier Part Number 1: P62ALCT-ND; Supplier Device Package: 1206; Tolerance: ±5%; Value: 62 Ohms
U?#2 = SN65HVD232DR: Manufacturer: Texas Instruments; Package Body Material: Plastic; Data Rate: 1000Mbps; Channels: 1; Package Equivalence Code: SOP8,.25; Power Supplies: 3.3V; Max Supply Current: 17uA; Telecom IC Type: INTERFACE CIRCUIT; Qualification Status: Not Qualified; Supplier: Digi-Key; Supplier Part Number: 296-26344-1-ND; Manufacturer Part Number: SN65HVD232DR; RoHS: Yes; Category: Interface ICs; Stock: 38986; Pricing: 1=2.55, 10=2.29, 25=2.1604, 100=1.8407, 250=1.72832, 500=1.5123, 1000=1.25305 (USD); Case/Package: SOP; Pins: 8; Package Shape: Rectangular; Terminal Finish: Nickel; Min Operating Temperature: -40°C; Max Operating Temperature: 85°C; JESD-609 Code: e4; JESD-30 Code: R-PDSO-G8; Moisture Sensitivity Level: 1; Number of Transceivers: 1; Package Style: SMALL OUTLINEMeter; Peak Reflow Temperature (Cel): 260°C; Nominal Supply Voltage: 3.3V; Surface Mount: Yes; Technology: BICMOS; Terminal Form: Gull Wing; Terminal Position: DUAL; Length: 4.9mm; Width: 3.9mm; Height - Seated (Max): 1.75mm; Terminal Pitch: 1.27mm; Temperature Grade: INDUSTRIAL; Reach SVHC Compliant: Yes; RoHS Compliant: Yes; ComponentLink1URL: https://www.ti.com:443/lit/ds/symlink/sn65hvd230.pdf?src-supplier=IHS+Markit; ComponentLink1Description: https://www.ti.com:443/lit/ds/symlink/sn65hvd230.pdf?src-supplier=IHS+Markit; ComponentLink2URL: https://datasheet.ciiva.com/1771/sn65hvd230-1771113.pdf?src-supplier=Digi-Key; ComponentLink2Description: https://datasheet.ciiva.com/1771/sn65hvd230-1771113.pdf?src-supplier=Digi-Key; ComponentLink3URL: https://datasheet.ciiva.com/1771/sn65hvd230-1771112.pdf?src-supplier=Digi-Key; ComponentLink3Description: https://datasheet.ciiva.com/1771/sn65hvd230-1771112.pdf?src-supplier=Digi-Key; ComponentLink4URL: https://datasheet.ciiva.com/1771/sn65hvd230-1771114.pdf?src-supplier=Digi-Key; ComponentLink4Description: https://datasheet.ciiva.com/1771/sn65hvd230-1771114.pdf?src-supplier=Digi-Key; ComponentLink5URL: https://datasheet.ciiva.com/15149/getdatasheetpartid-107534-15149958.pdf?src-supplier=Verical; ComponentLink5Description: https://datasheet.ciiva.com/15149/getdatasheetpartid-107534-15149958.pdf?src-supplier=Verical